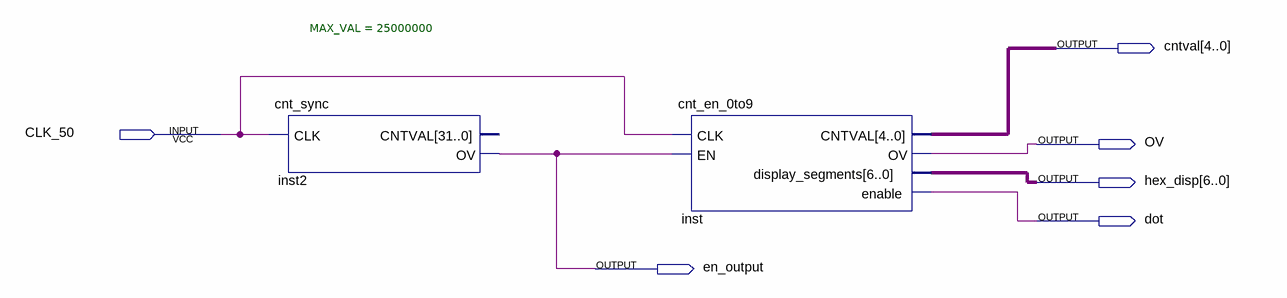
[diagram p0: schematic sheet]
// Quartus schematic start_4.bdf as structural Verilog: 2 symbols, 6 pins
module start_4 (
  input  CLK_50,
  output [4:0] cntval,
  output OV,
  output [6:0] hex_disp,
  output dot,
  output en_output
);

  cnt_sync #(.MAX_VAL(25000000)) inst2 (.CLK(CLK_50), .OV(en_output));  // open: CNTVAL
  cnt_en_0to9 inst (.CLK(CLK_50), .EN(en_output), .CNTVAL(cntval), .OV(OV), .display_segments(hex_disp), .enable(dot));
endmodule
